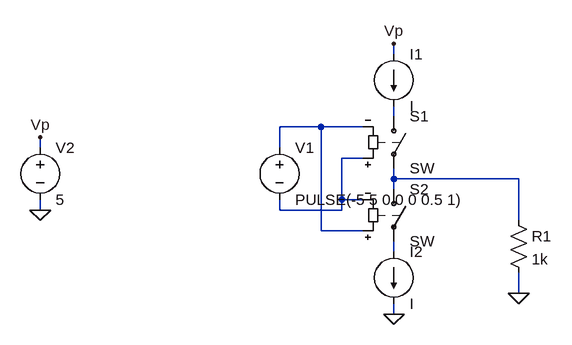
[diagram p0: schematic Test_timer_hack.asc]
Test_timer_hack.asc, the LTspice schematic file:
Version 4
SHEET 1 880 680
WIRE 224 16 224 0
WIRE 224 112 224 96
WIRE 112 128 48 128
WIRE 176 128 112 128
WIRE -320 160 -320 144
WIRE 48 160 48 128
WIRE 176 176 144 176
WIRE 224 208 224 192
WIRE 416 208 224 208
WIRE 224 224 224 208
WIRE 144 240 144 176
WIRE 176 240 144 240
WIRE -320 256 -320 240
WIRE 48 256 48 240
WIRE 144 256 144 240
WIRE 144 256 48 256
WIRE 416 272 416 208
WIRE 112 288 112 128
WIRE 176 288 112 288
WIRE 224 320 224 304
WIRE 416 384 416 352
WIRE 224 416 224 400
FLAG 224 0 Vp
FLAG 224 416 0
FLAG -320 256 0
FLAG -320 144 Vp
FLAG 416 384 0
SYMBOL current 224 16 R0
SYMATTR InstName I1
SYMBOL current 224 320 R0
SYMATTR InstName I2
SYMBOL sw 224 96 R0
SYMATTR InstName S1
SYMBOL sw 224 208 R0
SYMATTR InstName S2
SYMBOL voltage 48 144 R0
WINDOW 123 0 0 Left 0
WINDOW 39 0 0 Left 0
SYMATTR InstName V1
SYMATTR Value PULSE(-5 5 0 0 0 0.5 1)
SYMBOL voltage -320 144 R0
WINDOW 123 0 0 Left 0
WINDOW 39 0 0 Left 0
SYMATTR InstName V2
SYMATTR Value 5
SYMBOL res 400 256 R0
SYMATTR InstName R1
SYMATTR Value 1k

The netlist it stands for:
* Test_timer_hack.asc
I1 Vp N001 I
I2 N005 0 I
S1 N001 N004 N003 N002 SW
S2 N004 N005 N002 N003 SW
V1 N002 N003 PULSE(-5 5 0 0 0 0.5 1)
V2 Vp 0 5
R1 N004 0 1k
.backanno
.end